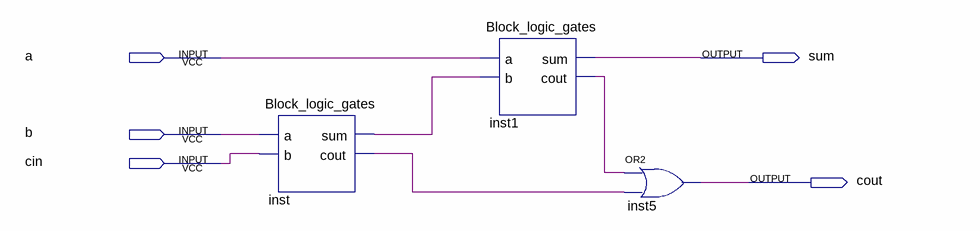
[diagram p0: schematic sheet]
// Quartus schematic Block_logic_2_half_adder.bdf as structural Verilog: 3 symbols, 5 pins
module Block_logic_2_half_adder (
  input  a,
  input  b,
  input  cin,
  output sum,
  output cout
);

  wire inst1_cout, inst_cout, inst_sum;

  Block_logic_gates inst (.a(b), .b(cin), .sum(inst_sum), .cout(inst_cout));
  Block_logic_gates inst1 (.a(a), .b(inst_sum), .sum(sum), .cout(inst1_cout));
  or inst5 (cout, inst1_cout, inst_cout);
endmodule
